# Altium schematic sheet Buck Converter.SchDoc
size A4
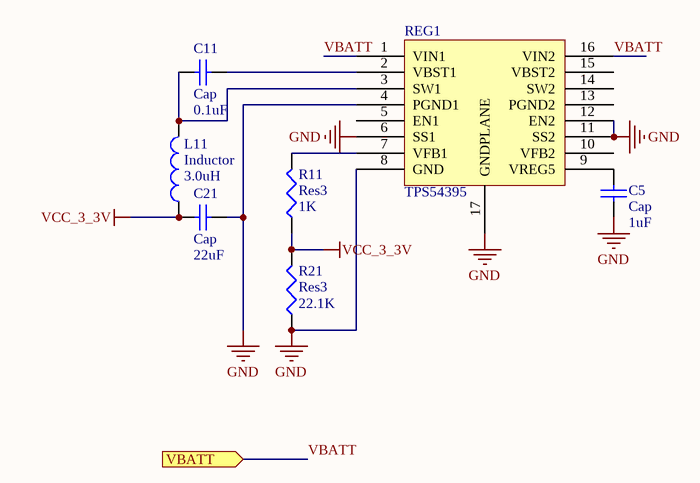
[diagram p0: Buck Converter.SchDoc]

## Parts
C5  Cap  value 1uF  [R0805]
C11  Cap  value 0.1uF  [R0805]
C21  Cap  value 22uF  [R0805]
L11  Inductor  value 3.0uH  [INDUCTOR]
R11  Res3  value 1K  [R0805]
R21  Res3  value 22.1K  [R0805]
REG1  TPS54395  [TPS54395]

## Ports
VBATT (in)

## Nets
GND: C5.2 C21.1 R21.1 REG1.4(PGND1) REG1.6(SS1) REG1.8(GND) REG1.11(SS2) REG1.12(EN2) REG1.17(GNDPLANE)
VCC_3_3V: C21.2 L11.1 R11.1 R21.2
VBATT: REG1.1(VIN1) REG1.16(VIN2) ; port VBATT
NetC5_1: C5.1 REG1.9(VREG5)
NetC11_1: C11.1 REG1.2(VBST1)
NetC11_2: C11.2 L11.2 REG1.3(SW1)
NetR11_2: R11.2 REG1.7(VFB1)

Not connected (* = marked no-connect by the designer): REG1 5(EN1) 10(VFB2) 13(PGND2) 14(SW2) 15(VBST2)

## Library data of the parts
C5 C11 C21 = Cap: Capacitor; Published: 8-Jun-2000; LatestRevisionDate: 17-Jul-2002; LatestRevisionNote: Re-released for DXP Platform.; PackageReference: RAD-0.3; Publisher: Altium Limited; PackageDescription: Radial Cap, Thru-Hole; 2 Leads; 0.3 in Pin Spacing
L11 = Inductor: Code_IEC: 1005; Published: 8-Jun-2000; LatestRevisionDate: 29-May-2009; LatestRevisionNote: IPC-7351 Footprint Added.; PackageReference: 0402-A; Publisher: Altium Limited; PackageDescription: Chip Inductor; Code_JEITA: 0402
R11 R21 = Res3: Resistor; Published: 8-Jun-2000; LatestRevisionDate: 29-May-2009; LatestRevisionNote: IPC-7351 Footprint Added.; PackageReference: J1-0603; Publisher: Altium Limited; PackageDescription: Chip Resistor
REG1 = TPS54395: Dual Channel Buck Converter